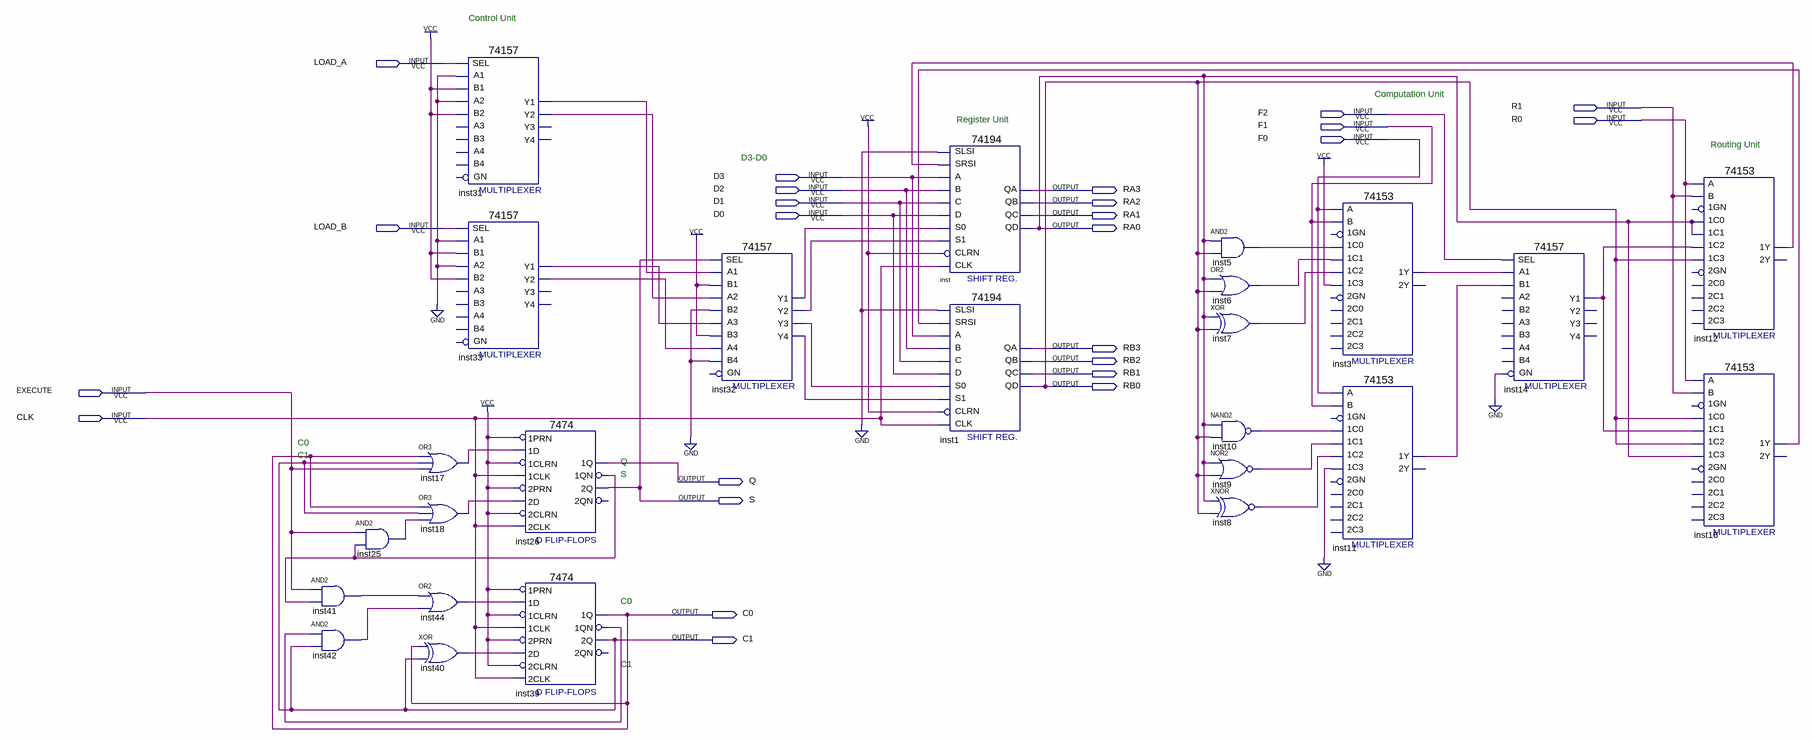
[diagram p0: schematic sheet]
// Quartus schematic lab3.bdf as structural Verilog: 25 symbols, 25 pins
module lab3 (
  input  LOAD_A,
  input  R1,
  input  F2,
  input  R0,
  input  F1,
  input  F0,
  input  D3,
  input  D2,
  input  D1,
  input  D0,
  input  LOAD_B,
  input  EXECUTE,
  input  CLK,
  output RA3,
  output RA2,
  output RA1,
  output RA0,
  output RB3,
  output RB2,
  output RB1,
  output RB0,
  output Q,
  output S,
  output C0,
  output C1
);

  wire inst3_1y, inst5_out, inst6_out, inst7_out, inst8_out, inst9_out, inst10_out, inst11_1y, inst12_1y,
       inst14_y1, inst16_1y, inst17_out, inst18_out, inst25_out, inst26_1qn, inst31_y1, inst31_y2, inst32_y1,
       inst32_y2, inst32_y3, inst32_y4, inst33_y1, inst33_y2, inst39_1qn, inst40_out, inst41_out, inst42_out,
       inst44_out;

  and inst41 (inst41_out, EXECUTE, inst26_1qn);
  and inst42 (inst42_out, inst39_1qn, C1);
  and inst25 (inst25_out, EXECUTE, inst26_1qn);
  or inst17 (inst17_out, C0, C1, EXECUTE);
  or inst18 (inst18_out, C0, C1, inst25_out);
  or inst44 (inst44_out, inst41_out, inst42_out);
  xor inst40 (inst40_out, C0, C1);
  \74157  inst31 (
    .A1(1'b0), .B1(1'b1), .SEL(LOAD_A), .B2(1'b1), .A2(1'b0), .Y2(inst31_y2), .Y1(inst31_y1));  // open: A3, B3, B4, GN, A4, Y4, Y3
  \74157  inst33 (
    .A1(1'b0), .B1(1'b1), .SEL(LOAD_B), .B2(1'b1), .A2(1'b0), .Y2(inst33_y2), .Y1(inst33_y1));  // open: A3, B3, B4, GN, A4, Y4, Y3
  \7474  inst26 (
    .\2D (inst18_out), .\2PRN (1'b1), .\1CLK (CLK), .\1D (inst17_out), .\1PRN (1'b1), .\2CLK (CLK),
    .\2CLRN (1'b1), .\1CLRN (1'b1), .\1QN (inst26_1qn), .\2Q (S), .\1Q (Q));  // open: 2QN
  \7474  inst39 (
    .\2D (inst40_out), .\2PRN (1'b1), .\1CLK (CLK), .\1D (inst44_out), .\1PRN (1'b1), .\2CLK (CLK),
    .\2CLRN (1'b1), .\1CLRN (1'b1), .\1QN (inst39_1qn), .\2Q (C1), .\1Q (C0));  // open: 2QN
  \74157  inst32 (
    .A1(inst31_y1), .B1(1'b1), .SEL(S), .B2(1'b0), .A3(inst33_y1), .B3(1'b1), .A2(inst31_y2), .B4(1'b0),
    .A4(inst33_y2), .Y2(inst32_y2), .Y1(inst32_y1), .Y4(inst32_y4), .Y3(inst32_y3));  // open: GN
  \74194  inst (
    .SLSI(1'b0), .SRSI(inst12_1y), .B(D2), .C(D1), .CLK(CLK), .CLRN(1'b1), .D(D0), .S1(inst32_y2),
    .S0(inst32_y1), .A(D3), .QA(RA3), .QB(RA2), .QC(RA1), .QD(RA0));
  \74194  inst1 (
    .SLSI(1'b0), .SRSI(inst16_1y), .B(D2), .C(D1), .CLK(CLK), .CLRN(1'b1), .D(D0), .S1(inst32_y4),
    .S0(inst32_y3), .A(D3), .QA(RB3), .QB(RB2), .QC(RB1), .QD(RB0));
  and inst5 (inst5_out, RA0, RB0);
  or inst6 (inst6_out, RA0, RB0);
  xor inst7 (inst7_out, RA0, RB0);
  nand inst10 (inst10_out, RA0, RB0);
  nor inst9 (inst9_out, RA0, RB0);
  xnor inst8 (inst8_out, RA0, RB0);
  \74153  inst3 (
    .\1C1 (inst6_out), .\1C0 (inst5_out), .\1C2 (inst7_out), .\1C3 (1'b1), .B(F1), .A(F0), .\1Y (inst3_1y));  // open: 1GN, 2C0, 2GN, 2C2, 2C1, 2C3, 2Y
  \74153  inst11 (
    .\1C1 (inst9_out), .\1C0 (inst10_out), .\1C2 (inst8_out), .\1C3 (1'b0), .B(F1), .A(F0), .\1Y (inst11_1y));  // open: 1GN, 2C0, 2GN, 2C2, 2C1, 2C3, 2Y
  \74157  inst14 (
    .A1(inst3_1y), .B1(inst11_1y), .SEL(F2), .GN(1'b0), .Y1(inst14_y1));  // open: B2, A3, B3, A2, B4, A4, Y2, Y4, Y3
  \74153  inst12 (
    .\1C1 (RA0), .\1C0 (RA0), .\1C2 (inst14_y1), .\1C3 (RB0), .B(R1), .A(R0), .\1Y (inst12_1y));  // open: 1GN, 2C0, 2GN, 2C2, 2C1, 2C3, 2Y
  \74153  inst16 (
    .\1C1 (inst14_y1), .\1C0 (RB0), .\1C2 (RB0), .\1C3 (RA0), .B(R1), .A(R0), .\1Y (inst16_1y));  // open: 1GN, 2C0, 2GN, 2C2, 2C1, 2C3, 2Y

  // Notes on the sheet:
  //   Control Unit
  //   Computation Unit
  //   Register Unit
  //   Routing Unit
  //   D3-D0
  //   C0
  //   C1
  //   Q
  //   S
  //   C0
  //   C1
endmodule
